# Altium schematic sheet FlowSensor.SchDoc
size A4
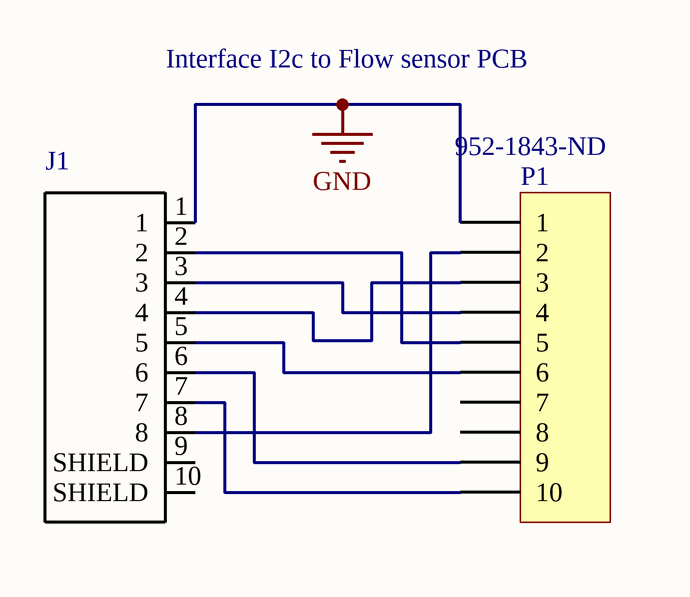
[diagram p0: FlowSensor.SchDoc]

## Parts
J1  RJ45-8N-B  [TE_RJ45-8N-B]  (value not drawn)
P1  Supplier Part Number 1: 952-1843-ND  [HDR1X10]

## Nets
GND: J1.1 P1.1
NetJ1_2: J1.2 P1.5
NetJ1_3: J1.3 P1.4
NetJ1_4: J1.4 P1.3
NetJ1_5: J1.5 P1.6
NetJ1_6: J1.6 P1.9
NetJ1_7: J1.7 P1.10
NetJ1_8: J1.8 P1.2

Not connected (* = marked no-connect by the designer): J1 9(SHIELD) 10(SHIELD); P1 7 8

## Notes on the sheet
- Interface I2c to Flow sensor PCB

## Library data of the parts
J1 = RJ45-8N-B: Corcom; Filter; Signal Line; Modular; 8 Contacts; 1 Port Through Hole; MF: TE Connectivity; SnapEDA_Link: https://www.snapeda.com/parts/RJ45-8N-B/TE%2520Connectivity%2520Corcom%2520Filters/view-part/?ref=snap; Price: 5.65 USD; Package: None; MP: RJ45-8N-B; Availability: Good; Value: *; Supplier 1: Digi-Key; Supplier Part Number 1: CCM1500-ND
P1 = Header 10: Header, 10-Pin; LatestRevisionDate: 17-Jul-2002; LatestRevisionNote: Re-released for DXP Platform.; Publisher: Altium Limited; Supplier 1: Digi-Key